# EAGLE schematic Distribution_board (EAGLE 8.0.1)
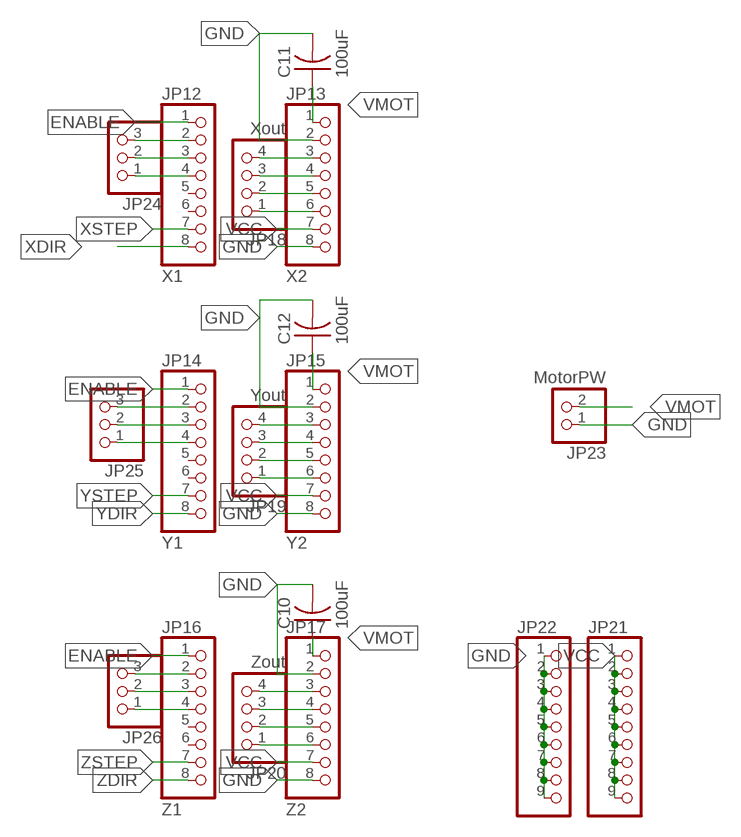
[diagram p0: schematic, sheet 1]

## Parts
C10  100uF  CAP-US1206  [C1206]
C11  100uF  CAP-US1206  [C1206]
C12  100uF  CAP-US1206  [C1206]
JP12  X1  PINHD-1X8  [1X08]
JP13  X2  PINHD-1X8  [1X08]
JP14  Y1  PINHD-1X8  [1X08]
JP15  Y2  PINHD-1X8  [1X08]
JP16  Z1  PINHD-1X8  [1X08]
JP17  Z2  PINHD-1X8  [1X08]
JP18  Xout  PINHD-1X4  [1X04]
JP19  Yout  PINHD-1X4  [1X04]
JP20  Zout  PINHD-1X4  [1X04]
JP21  PINHD-1X9  [1X09]
JP22  PINHD-1X9  [1X09]
JP23  MotorPW  PINHD-1X2  [1X02]
JP24  PINHD-1X3  [1X03]
JP25  PINHD-1X3  [1X03]
JP26  PINHD-1X3  [1X03]

## Nets
ENABLE: JP12.1 JP14.1 JP16.1
GND: C10.2 C11.2 C12.2 JP13.2 JP13.8 JP15.2 JP15.8 JP17.2 JP17.8 JP22.1 JP22.2 JP22.3 JP22.4 JP22.5 JP22.6 JP22.7 JP22.8 JP22.9 JP23.1
N$19: JP17.3 JP20.4
N$25: JP17.4 JP20.3
N$31: JP17.5 JP20.2
N$32: JP17.6 JP20.1
N$33: JP15.6 JP19.1
N$34: JP15.5 JP19.2
N$35: JP15.4 JP19.3
N$36: JP15.3 JP19.4
N$37: JP13.3 JP18.4
N$38: JP13.4 JP18.3
N$39: JP13.5 JP18.2
N$40: JP13.6 JP18.1
N$41: JP12.2 JP24.3
N$42: JP12.3 JP24.2
N$43: JP12.4 JP24.1
N$44: JP14.2 JP25.3
N$45: JP14.3 JP25.2
N$46: JP14.4 JP25.1
N$47: JP16.2 JP26.3
N$48: JP16.3 JP26.2
N$49: JP16.4 JP26.1
VCC: JP13.7 JP15.7 JP17.7 JP21.1 JP21.2 JP21.3 JP21.4 JP21.5 JP21.6 JP21.7 JP21.8 JP21.9
VMOT: C10.1 C11.1 C12.1 JP13.1 JP15.1 JP17.1 JP23.2
XDIR: JP12.8
XSTEP: JP12.7
YDIR: JP14.8
YSTEP: JP14.7
ZDIR: JP16.8
ZSTEP: JP16.7
Unconnected: JP12.5 JP12.6 JP14.5 JP14.6 JP16.5 JP16.6

## Library data of the parts
C10-C12 = fab:CAP-US
JP12-JP17 = pinhead:PINHD-1X8: PIN HEADER
JP18-JP20 = pinhead:PINHD-1X4: PIN HEADER
JP21 JP22 = pinhead:PINHD-1X9: PIN HEADER
JP23 = pinhead:PINHD-1X2: PIN HEADER
JP24-JP26 = pinhead:PINHD-1X3: PIN HEADER